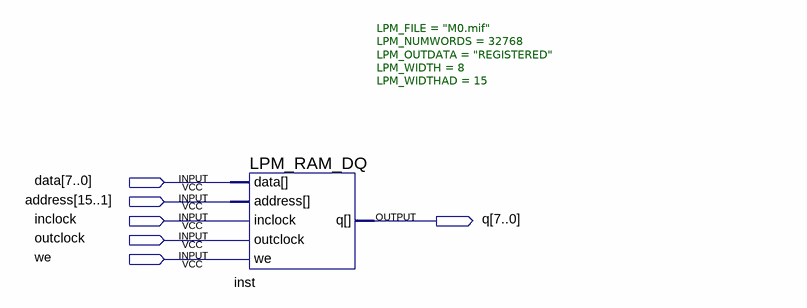
[diagram p0: schematic sheet]
// Quartus schematic test.bdf as structural Verilog: 1 symbols, 6 pins
module test (
  input  [7:0] data,
  input  [15:1] address,
  input  inclock,
  input  outclock,
  input  we,
  output [7:0] q
);

  LPM_RAM_DQ #(.LPM_FILE("M0.mif"), .LPM_NUMWORDS(32768), .LPM_OUTDATA("REGISTERED"), .LPM_WIDTH(8), .LPM_WIDTHAD(15)) inst (
    .inclock(inclock), .data(data), .address(address), .we(we), .outclock(outclock), .q(q));
endmodule
